# EAGLE schematic maxim (EAGLE 6.4)
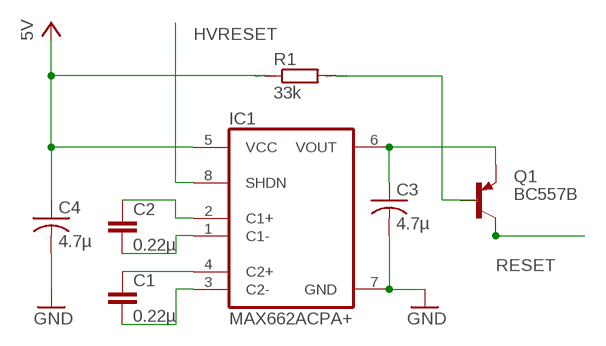
[diagram p0: schematic, sheet 1]

## Parts
C1  0.22µ  C-EU025-024X044  [C025-024X044]
C2  0.22µ  C-EU025-024X044  [C025-024X044]
C3  4.7µ  C-US025-024X044  [C025-024X044]
C4  4.7µ  C-US025-024X044  [C025-024X044]
IC1  MAX662ACPA+  MAX662CPA  [DIL08]
Q1  BC557B  [TO92-EBC]
R1  33k  R  [R0805]

## Nets
GND: C3.2 C4.2 IC1.7(GND)
HVRESET: IC1.8(SHDN)
N$1: C1.1 IC1.4(C2+)
N$2: C1.2 IC1.3(C2-)
N$3: C2.1 IC1.2(C1+)
N$4: C2.2 IC1.1(C1-)
N$7: R1.2
RESET: Q1.C
SVCC: C4.1 IC1.5(VCC) R1.1 ; supply symbol labelled 5V
VOUT: C3.1 IC1.6(VOUT) Q1.E
Unconnected: Q1.B

## Library data of the parts
C1 C2 = rcl:C-EU: CAPACITOR, European symbol
C3 C4 = rcl:C-US: CAPACITOR, American symbol
IC1 = maxim:MAX662CPA: SUPPLY CHARGE PUMP; OC_FARNELL: unknown; OC_NEWARK: unknown
Q1 = transistor-pnp:BC557*: PNP Transistror
R1 = eagle-ltspice:R: RESISTOR, European symbol; SPICEMODEL: NONE; SPICEPREFIX: R